# Altium schematic sheet 01 POWER.SchDoc
size A4
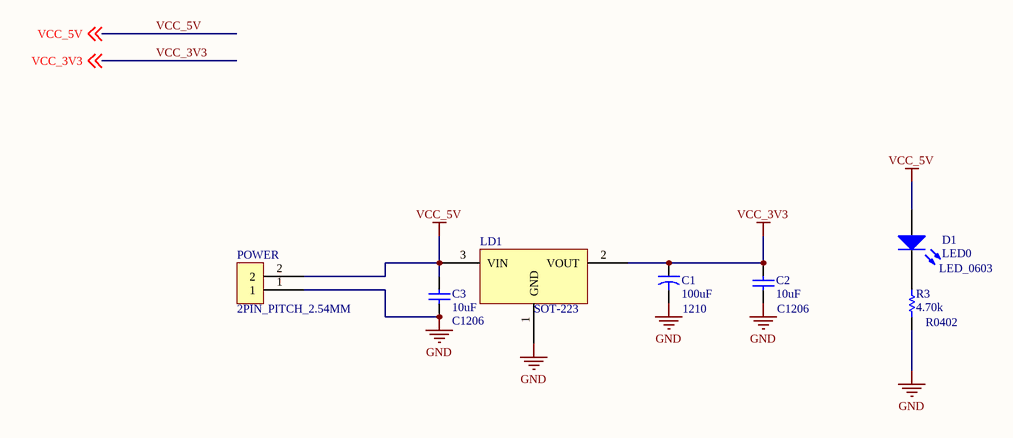
[diagram p0: 01 POWER.SchDoc]

## Parts
C1  100uF  [1210]
C2  10uF  [C1206]
C3  10uF  [C1206]
D1  LED0  [LED_0603]
LD1  SOT-223  [LD1117S33TR]
POWER  2PIN_PITCH_2.54MM  [2PIN_PITCH_2.54MM]
R3  4.70k  [R0402]

## Nets
GND: C1.2 C2.1 C3.1 LD1.1(GND) POWER.1 R3.2
VCC_3V3: C1.1 C2.2 LD1.2(VOUT) ; off-sheet VCC_3V3
VCC_5V: C3.2 D1.1(A) LD1.3(VIN) POWER.2 ; off-sheet VCC_5V
NetD1_2: D1.2(K) R3.1

## Library data of the parts
C1 = Cap2: Capacitor; Value: 100pF; Published: 23-Sep-2002; PackageReference: CAPR5-4X5; Publisher: Altium Limited; PackageDescription: Capacitor; 2 Leads
C2 = Cap: Capacitor; Value: 100pF; Published: 8-Jun-2000; LatestRevisionDate: 17-Jul-2002; LatestRevisionNote: Re-released for DXP Platform.; PackageReference: RAD-0.3; Publisher: Altium Limited; PackageDescription: Radial Cap, Thru-Hole; 2 Leads; 0.3 in Pin Spacing
C3 = Cap: Capacitor; Published: 8-Jun-2000; LatestRevisionDate: 17-Jul-2002; LatestRevisionNote: Re-released for DXP Platform.; PackageReference: C1206; Publisher: Altium Limited; PackageDescription: Radial Cap, Thru-Hole; 2 Leads; 0.3 in Pin Spacing
D1 = LED0: Typical INFRARED GaAs LED; Published: 8-Jun-2000; LatestRevisionDate: 08-Jul-2005; LatestRevisionNote: Mech Layer 1 removed.; PackageReference: LED-0; Publisher: Altium Limited; PackageDescription: LED; 2 Leads; footpriint: LED_0603
LD1 = LD1117S33TR
R3 = Res1: Resistor; Value: 1K; Published: 8-Jun-2000; LatestRevisionDate: 17-Jul-2002; LatestRevisionNote: Re-released for DXP Platform.; PackageReference: AXIAL-0.3; Publisher: Altium Limited; PackageDescription: Axial Device, Thru-Hole; 2 Leads; 0.3 in Pin Spacing